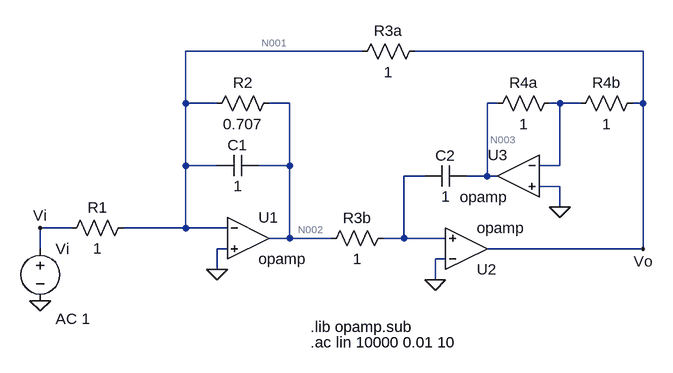
[diagram p0: schematic Simulacion LTspice.asc]
Simulacion LTspice.asc, the LTspice schematic file:
Version 4
SHEET 1 912 680
WIRE 432 -80 160 -80
WIRE 864 -80 512 -80
WIRE 160 0 160 -80
WIRE 208 0 160 0
WIRE 320 0 288 0
WIRE 640 0 624 0
WIRE 736 0 720 0
WIRE 768 0 736 0
WIRE 864 0 864 -80
WIRE 864 0 848 0
WIRE 160 96 160 0
WIRE 208 96 160 96
WIRE 320 96 320 0
WIRE 320 96 272 96
WIRE 736 96 736 0
WIRE 736 96 704 96
WIRE 528 112 496 112
WIRE 624 112 624 0
WIRE 624 112 592 112
WIRE 640 112 624 112
WIRE 736 128 704 128
WIRE 736 160 736 128
WIRE -16 192 -64 192
WIRE 160 192 160 96
WIRE 160 192 64 192
WIRE 224 192 160 192
WIRE 320 208 320 96
WIRE 320 208 288 208
WIRE 384 208 320 208
WIRE 496 208 496 112
WIRE 496 208 464 208
WIRE 560 208 496 208
WIRE -64 224 -64 192
WIRE 224 224 208 224
WIRE 864 224 864 0
WIRE 864 224 624 224
WIRE 560 240 544 240
WIRE 208 256 208 224
WIRE 544 272 544 240
FLAG 208 256 0
FLAG 544 272 0
FLAG 736 160 0
FLAG -64 192 Vi
FLAG 864 224 Vo
FLAG -64 304 0
SYMBOL res 80 176 R90
WINDOW 0 0 56 VBottom 2
WINDOW 3 32 56 VTop 2
SYMATTR InstName R1
SYMATTR Value 1
SYMBOL res 304 -16 R90
WINDOW 0 0 56 VBottom 2
WINDOW 3 32 56 VTop 2
SYMATTR InstName R2
SYMATTR Value 0.707
SYMBOL res 480 192 R90
WINDOW 0 0 56 VBottom 2
WINDOW 3 32 56 VTop 2
SYMATTR InstName R3b
SYMATTR Value 1
SYMBOL res 736 -16 R90
WINDOW 0 0 56 VBottom 2
WINDOW 3 32 56 VTop 2
SYMATTR InstName R4a
SYMATTR Value 1
SYMBOL res 864 -16 R90
WINDOW 0 0 56 VBottom 2
WINDOW 3 32 56 VTop 2
SYMATTR InstName R4b
SYMATTR Value 1
SYMBOL res 528 -96 R90
WINDOW 0 0 56 VBottom 2
WINDOW 3 32 56 VTop 2
SYMATTR InstName R3a
SYMATTR Value 1
SYMBOL OpAmps\\opamp 256 144 R0
SYMATTR InstName U1
SYMBOL OpAmps\\opamp 592 288 M180
SYMATTR InstName U2
SYMBOL OpAmps\\opamp 672 48 M0
SYMATTR InstName U3
SYMBOL cap 592 96 R90
WINDOW 0 0 32 VBottom 2
WINDOW 3 32 32 VTop 2
SYMATTR InstName C2
SYMATTR Value 1
SYMBOL cap 272 80 R90
WINDOW 0 0 32 VBottom 2
WINDOW 3 32 32 VTop 2
SYMATTR InstName C1
SYMATTR Value 1
SYMBOL voltage -64 208 R0
WINDOW 123 24 124 Left 2
WINDOW 39 0 0 Left 0
SYMATTR Value2 AC 1
SYMATTR InstName Vi
SYMATTR Value ""
TEXT 352 344 Left 2 !.lib opamp.sub
TEXT 352 368 Left 2 !.ac lin 10000 0.01 10

The netlist it stands for:
* Simulacion LTspice.asc
R1 N001 Vi 1
R2 N002 N001 0.707
R3b N005 N002 1
R4a N004 N003 1
R4b Vo N004 1
R3a Vo N001 1
XU1 N001 0 N002 opamp Aol=100K GBW=10Meg  ; pins invin noninvin out
XU2 0 N005 Vo opamp Aol=100K GBW=10Meg  ; pins invin noninvin out
XU3 N004 0 N003 opamp Aol=100K GBW=10Meg  ; pins invin noninvin out
C2 N003 N005 1
C1 N002 N001 1
Vi Vi 0 AC 1
.lib opamp.sub
.ac lin 10000 0.01 10
.backanno
.end

* Results of the author's LTspice run, read from the files saved beside the schematic
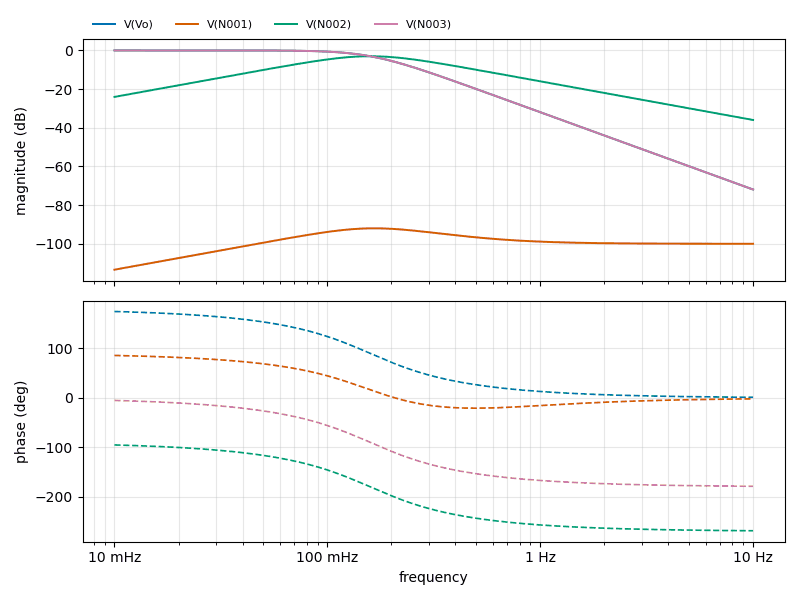
[diagram p1: AC Analysis of Simulacion LTspice.asc, plotted from the saved traces]
* AC Analysis, 1 run:
*   V(Vo): -0.00 dB at 10 mHz, -71.93 dB at 10 Hz, peak -0.00 dB at 10 mHz, 3 dB below the peak at 159.1 mHz
*   V(N001): -113.37 dB at 10 mHz, -99.97 dB at 10 Hz, peak -91.97 dB at 165.9 mHz, 3 dB below the peak at 85.39 mHz and 358.7 mHz
*   V(N002): -24.04 dB at 10 mHz, -35.96 dB at 10 Hz, peak -3.01 dB at 158.9 mHz, 3 dB below the peak at 82.38 mHz and 307.5 mHz
*   V(N003): -0.00 dB at 10 mHz, -71.93 dB at 10 Hz, peak -0.00 dB at 10 mHz, 3 dB below the peak at 159.1 mHz